# Altium project OSP_DJB_Rigid.PrjPcb
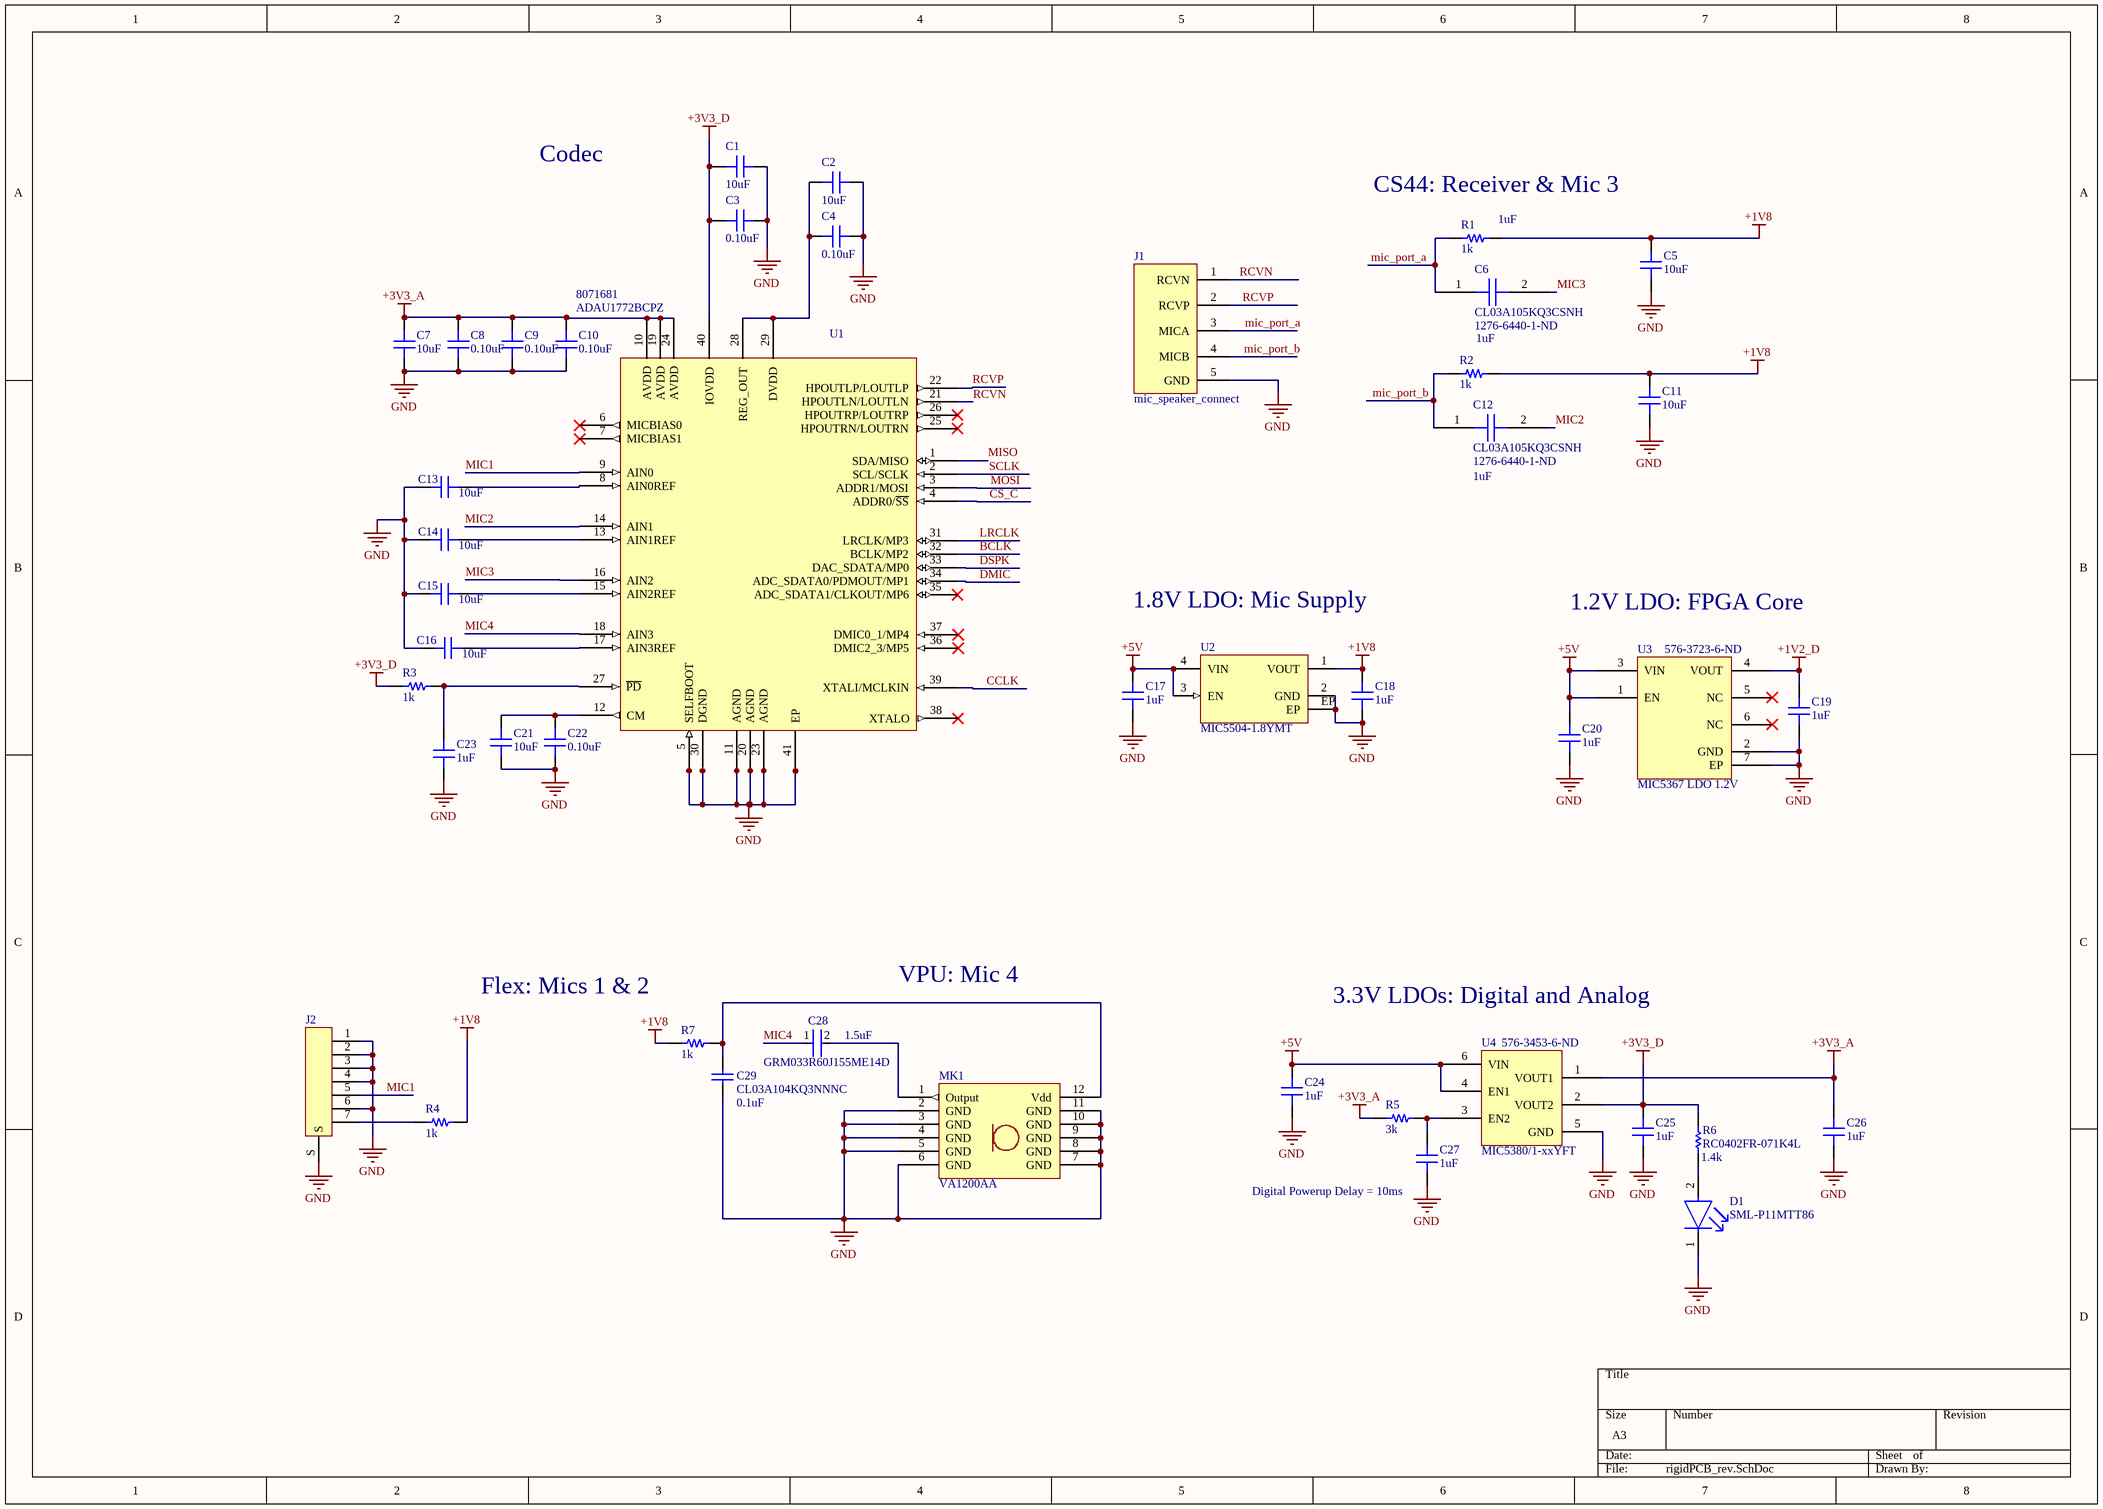
[diagram p0: rigidPCB_rev.SchDoc]
2 sheets, 73 parts. Net scope: global (net labels, ports and power ports of the same name join across sheets).
Board files: djb_v2_rigid_right_1.PcbDoc, djb_v2_rigid_left_2.PcbDoc, djb_v2_rigid_panel.PcbDoc, djb_v2_rigid_left_rev.PcbDoc
Sheets:
  rigidPCB_rev.SchDoc
  rigidPCB2_rev.SchDoc

## Sheet rigidPCB_rev.SchDoc
size A3; SheetNumber: 1; SheetTotal: 2

### Parts
C1  10uF  [CAP 0402/1005]
C2  10uF  [CAP 0402/1005]
C3  0.10uF  [CAP 0201/0603]
C4  0.10uF  [CAP 0201/0603]
C5  10uF  [CAP 0402/1005]
C6  CL03A105KQ3CSNH  Supplier Part Number 1: 1276-6440-1-ND  [CL03A105KQ3CSNH]
C7  10uF  [CAP 0402/1005]
C8  0.10uF  [CAP 0201/0603]
C9  0.10uF  [CAP 0201/0603]
C10  0.10uF  [CAP 0201/0603]
C11  10uF  [CAP 0402/1005]
C12  CL03A105KQ3CSNH  Supplier Part Number 1: 1276-6440-1-ND  [CL03A105KQ3CSNH]
C13  10uF  [CAP 0402/1005]
C14  10uF  [CAP 0402/1005]
C15  10uF  [CAP 0402/1005]
C16  10uF  [CAP 0402/1005]
C17  1uF  [CAP 0201/0603]
C18  1uF  [CAP 0201/0603]
C19  1uF  [CAP 0201/0603]
C20  1uF  [CAP 0201/0603]
C21  10uF  [CAP 0402/1005]
C22  0.10uF  [CAP 0201/0603]
C23  1uF  [CAP 0201/0603]
C24  1uF  [CAP 0201/0603]
C25  1uF  [CAP 0201/0603]
C26  1uF  [CAP 0201/0603]
C27  1uF  [CAP 0201/0603]
C28  GRM033R60J155ME14D  [FP-GRM033-0_03-IPC_B]
C29  CL03A104KQ3NNNC  [CAPC0603X33X15ML03T05]
D1  SML-P11MTT86  [FP-SML-P11MTT86-MFG]
J1  mic_speaker_connect
J2  FFC  [HIROSE_FH58M-7S-0.25SHW-99]  (value not drawn)
MK1  VA1200AA  [VA1200AA]
R1  1k  [RES 0201/0603]
R2  1k  [RES 0201/0603]
R3  1k  [RES 0201/0603]
R4  1k  [RES 0201/0603]
R5  3k  [RES 0201/0603]
R6  RC0402FR-071K4L  [RESC1005X40X25NL05T10]
R7  1k  [RES 0201/0603]
U1  Supplier Part Number 2: 8071681  [ADAU1772BCPZ]
U2  MIC5504-1.8YMT  [MICREL_DFN4]
U3  MIC5367 LDO 1.2V  Supplier Part Number 1: 576-3723-6-ND  [LDO 1.2V]
U4  MIC5380/1-xxYFT  Supplier Part Number 1: 576-3453-6-ND  [06L FCSTSLP]

### Nets
+1V2_D: C19.2 U3.4(VOUT)  [project net VCC]
+1V8: C5.2 C11.2 C18.2 R1.2 R2.2 R4.2 R7.1 U2.1(VOUT)
+3V3_A: C7.1 C8.2 C9.2 C10.2 C26.2 R5.1 U1.10(AVDD) U1.19(AVDD) U1.24(AVDD) U4.1(VOUT1)
+3V3_D: C1.2 C3.1 C25.2 R3.1 R6.2 U1.40(IOVDD) U4.2(VOUT2)  [project net SPI_VCCIO1]
+5V: C17.2 C20.2 C24.2 U2.3(EN) U2.4(VIN) U3.1(EN) U3.3(VIN) U4.4(EN1) U4.6(VIN)
GND: C1.1 C2.1 C3.2 C4.2 C5.1 C7.2 C8.1 C9.1 C10.1 C11.1 C13.2 C14.2 C15.2 C16.2 C17.1 C18.1 C19.1 C20.1 C21.2 C22.1 C23.1 C24.1 C25.1 C26.1 C27.1 C29.1 D1.1(C) J1.5(GND) J2.1 J2.2 J2.3 J2.4 J2.6 J2.S MK1.2(GND) MK1.3(GND) MK1.4(GND) MK1.5(GND) MK1.6(GND) MK1.7(GND) MK1.8(GND) MK1.9(GND) MK1.10(GND) MK1.11(GND) U1.5(SELFBOOT) U1.11(AGND) U1.20(AGND) U1.23(AGND) U1.30(DGND) U1.41(EP) U2.2(GND) U2.EP U3.2(GND) U3.7(EP) U4.5(GND)
BCLK: U1.32(BCLK/MP2)
CCLK: U1.39(XTALI/MCLKIN)
CS_C: U1.4(ADDR0/~{SS})
DMIC: U1.34(ADC_SDATA0/PDMOUT/MP1)
DSPK: U1.33(DAC_SDATA/MP0)
LRCLK: U1.31(LRCLK/MP3)
MIC1: J2.5 U1.9(AIN0)
MIC2: C12.2 U1.14(AIN1)
MIC3: C6.2 U1.16(AIN2)
MIC4: C28.1 U1.18(AIN3)
mic_port_a: C6.1 J1.3(MICA) R1.1
mic_port_b: C12.1 J1.4(MICB) R2.1
MISO: U1.1(SDA/MISO)
MOSI: U1.3(ADDR1/MOSI)
RCVN: J1.1(RCVN) U1.21(HPOUTLN/LOUTLN)
RCVP: J1.2(RCVP) U1.22(HPOUTLP/LOUTLP)
SCLK: U1.2(SCL/SCLK)
NetC2_2: C2.2 C4.1 U1.28(REG_OUT) U1.29(DVDD)
NetC13_1: C13.1 U1.8(AIN0REF)
NetC14_1: C14.1 U1.13(AIN1REF)
NetC15_1: C15.1 U1.15(AIN2REF)
NetC16_1: C16.1 U1.17(AIN3REF)
NetC21_1: C21.1 C22.2 U1.12(CM)
NetC23_2: C23.2 R3.2 U1.27(~{PD})
NetC27_2: C27.2 R5.2 U4.3(EN2)
NetC28_2: C28.2 MK1.1(Output)
NetC29_2: C29.2 MK1.12(Vdd) R7.2
NetD1_2: D1.2(A) R6.1
NetJ2_7: J2.7 R4.1

Not connected (* = marked no-connect by the designer): U1 6(MICBIAS0) 7(MICBIAS1) 25(HPOUTRN/LOUTRN)* 26(HPOUTRP/LOUTRP)* 35(ADC_SDATA1/CLKOUT/MP6)* 36(DMIC2_3/MP5)* 37(DMIC0_1/MP4)* 38(XTALO)*; U3 5(NC)* 6(NC)*

### Notes on the sheet
- Codec
- CS44: Receiver & Mic 3
- (near R1) 1uF
- 1uF
- (near C12) 1uF
- 1.8V LDO: Mic Supply
- 1.2V LDO: FPGA Core
- VPU: Mic 4
- (near J2) Flex: Mics 1 & 2
- (near C28) 1.5uF
- 3.3V LDOs: Digital and Analog
- (near C29) 0.1uF
- (near C27) Digital Powerup Delay = 10ms
- (near R6) 1.4k

### Library data of the parts
C1 C2 C5 C7 C11 C13-C16 C21 = C1005X5R0J106M050BC: CAP CER 10UF 6.3V X5R 0402; Manufacturer: TDK Corporation; TemperatureRange: -55C ~ 85C; Tolerance: 20%; Value: 10uF; Part Number: C1005X5R0J106M050BC; PartId: 12380; Supplier 1: Digi-Key; Supplier Part Number 1: 445-8920-2-ND; ComponentLink1Description: Datasheet; ComponentLink1URL: https://product.tdk.com/info/en/catalog/datasheets/mlcc_commercial_general_en.pdf; ComponentLink2Description: Digi-Key Listing; ComponentLink2URL: https://www.digikey.com/product-detail/en/tdk-corporation/C1005X5R0J106M050BC/445-8920-2-ND/3507809; TemperatureCoefficient: X5R; Voltage: 6.3V; Price: 0.119; Device Package: 0402 (1005 Metric)
C3 C4 C8-C10 C22 = CL03A104KP3NNNC: CAP CER 0.1UF 10V X5R 0201; Manufacturer: Samsung Electro-Mechanics America, Inc.; TemperatureRange: -55C ~ 85C; Tolerance: 10%; Value: 0.10uF; Part Number: CL03A104KP3NNNC; PartId: 20562; Supplier 1: Digi-Key; Supplier Part Number 1: 1276-1115-2-ND; ComponentLink1Description: Datasheet; ComponentLink1URL: http://www.samsungsem.com/kr/support/product-search/mlcc/__icsFiles/afieldfile/2016/08/18/S_CL03A104KP3NNND.pdf; ComponentLink2Description: Digi-Key Listing; ComponentLink2URL: https://www.digikey.com/product-detail/en/samsung-electro-mechanics-america-inc/CL03A104KP3NNNC/1276-1115-2-ND/3886773; TemperatureCoefficient: X5R; Voltage: 10V; Price: 0.0031; Device Package: 0201 (0603 Metric)
C6 C12 = CL03A105KQ3CSNH: 1 µF ±10% 6.3V Ceramic Capacitor X5R 0201 (0603 Metric); Supplier 1: Digi-Key
C17-C20 C23-C27 = 02016D105MAT2A: CAP CER 1UF 6.3V X5R 0201; Manufacturer: AVX Corporation; TemperatureRange: -55C ~ 85C; Tolerance: 20%; Value: 1uF; Part Number: 02016D105MAT2A; PartId: 20442; Supplier 1: Digi-Key; Supplier Part Number 1: 478-7862-2-ND; ComponentLink1Description: Datasheet; ComponentLink1URL: http://datasheets.avx.com/cx5r.pdf; ComponentLink2Description: Digi-Key Listing; ComponentLink2URL: https://www.digikey.com/product-detail/en/avx-corporation/02016D105MAT2A/478-7862-2-ND/3079664; TemperatureCoefficient: X5R; Voltage: 6.3V; Price: 0.063; Device Package: 0201 (0603 Metric)
C28 = CMP-06035-017352-1: Chip Multilayer Ceramic Capacitors for General Purpose, 0201, 1.5uF, X5R, 15%, 20%, 6.3V; Case/Package: 0201; Packaging: Tape and Reel; Case Code (Imperial): 0201; Capacitance: 1.5uF; Max Operating Temperature: 85°C; Voltage Rating (DC): 6.3V; Dielectric: X5R; Min Operating Temperature: -55°C; Voltage Rating: 6.3V; Tolerance: 20%; Mount: Surface Mount; Case Code (Metric): 0603; Thickness: 0.013inch; Length: 0.024inch; Width: 0.012inch
C29 = CMP-2010-00674-1: Manufacturer: Samsung; Part Number: CL03A104KQ3NNNC
D1 = CMP-2000-07126-2: LED YELLOW/GREEN CLEAR 1006 SMD; Forward Current: 20mA; Lens Color: Colorless; Power Rating: 54mW; Lens Style: Diffused; Wavelength: 569nm; Viewing Angle: 150°; Number of LEDs: 1; Test Current: 1mA; Luminous Intensity: 2.1mcd; Illumination Color: Green; Forward Voltage: 1.9V; REACH SVHC: No SVHC; Mount: Surface Mount; Series: PicoLED™; Case Code (Imperial): 0402; Min Operating Temperature: -40°C; Max Operating Temperature: 85°C; Number of Pins: 2; Package Quantity: 1; Height: 0.25mm; Lens Transparency: Clear; Case Code (Metric): 1005; Packaging: Tape and Reel; Width: 0.6mm; Radiation Hardening: No; Case/Package: 0402; Lead Free: Lead Free; Color: Green; RoHS Compliant: Yes; Length: 1mm; Dominant Wavelength: 569nm
J1 = mic_speaker_connect: connector to integrated microphone and speaker
J2 = HIROSE_FH58M-7S-0.25SHW-99: Hirose FH58M-7S-0.25SHW(99) 7-pin Top+Bottom Contact FFC Connector
MK1 = VA1200AA: Bone Conductor Sensor Accelerometer
R1-R4 R7 = RC0201JR-071KL: RES SMD 1K OHM 5% 1/20W 0201; Manufacturer: Yageo; TemperatureRange: -55C ~ 125C; TemperatureCoefficient: 200ppm/C; PowerRating: 0.05W, 1/20W; Value: 1k; Part Number: RC0201JR-071KL; PartId: 19463; Supplier 1: Digi-Key; Supplier Part Number 1: 311-1KNTR-ND; ComponentLink1Description: Datasheet; ComponentLink1URL: http://www.yageo.com/documents/recent/PYu-RC_Group_51_RoHS_L_04.pdf; ComponentLink2Description: Digi-Key Listing; ComponentLink2URL: https://www.digikey.com/product-detail/en/yageo/RC0201JR-071KL/311-1KNTR-ND/1948922; Tolerance: 5%; Price: 0.0042; Device Package: 0201 (0603 Metric)
R5 = RC0201FR-073KL: RES SMD 3K OHM 1% 1/20W 0201; Manufacturer: Yageo; TemperatureRange: -55C ~ 125C; TemperatureCoefficient: 200ppm/C; PowerRating: 0.05W, 1/20W; Value: 3k; Part Number: RC0201FR-073KL; PartId: 19520; Supplier 1: Digi-Key; Supplier Part Number 1: YAG2656TR-ND; ComponentLink1Description: Datasheet; ComponentLink1URL: http://www.yageo.com/documents/recent/PYu-RC_Group_51_RoHS_L_04.pdf; ComponentLink2Description: Digi-Key Listing; ComponentLink2URL: https://www.digikey.com/product-detail/en/yageo/RC0201FR-073KL/YAG2656TR-ND/5280516; Tolerance: 1%; Price: 0.0042; Device Package: 0201 (0603 Metric)
R6 = CMP-2002-07461-1: Manufacturer: Yageo / Phycomp; Part Number: RC0402FR-071K4L
U1 = ADAU1772BCPZ: General Purpose Audio Codec 4ADC / 2DAC Ch 40-Pin LFCSP; Supplier 1: Arrow Electronics; Supplier Part Number 1: ADAU1772BCPZ; Supplier 2: RSComponents
U2 = MICREL_MIC5504-1.8YMT: Micrel MIC5504-1.8YMT 1.8V 300mA LDO
U4 = MIC5380/1-xxYFT: LDO 2fixed Outputs; Supplier 1: Digi-Key
U3 = MIC5367 LDO 1.2V: Supplier 1: Digi-Key

## Sheet rigidPCB2_rev.SchDoc
size A3; SheetNumber: 2; SheetTotal: 2
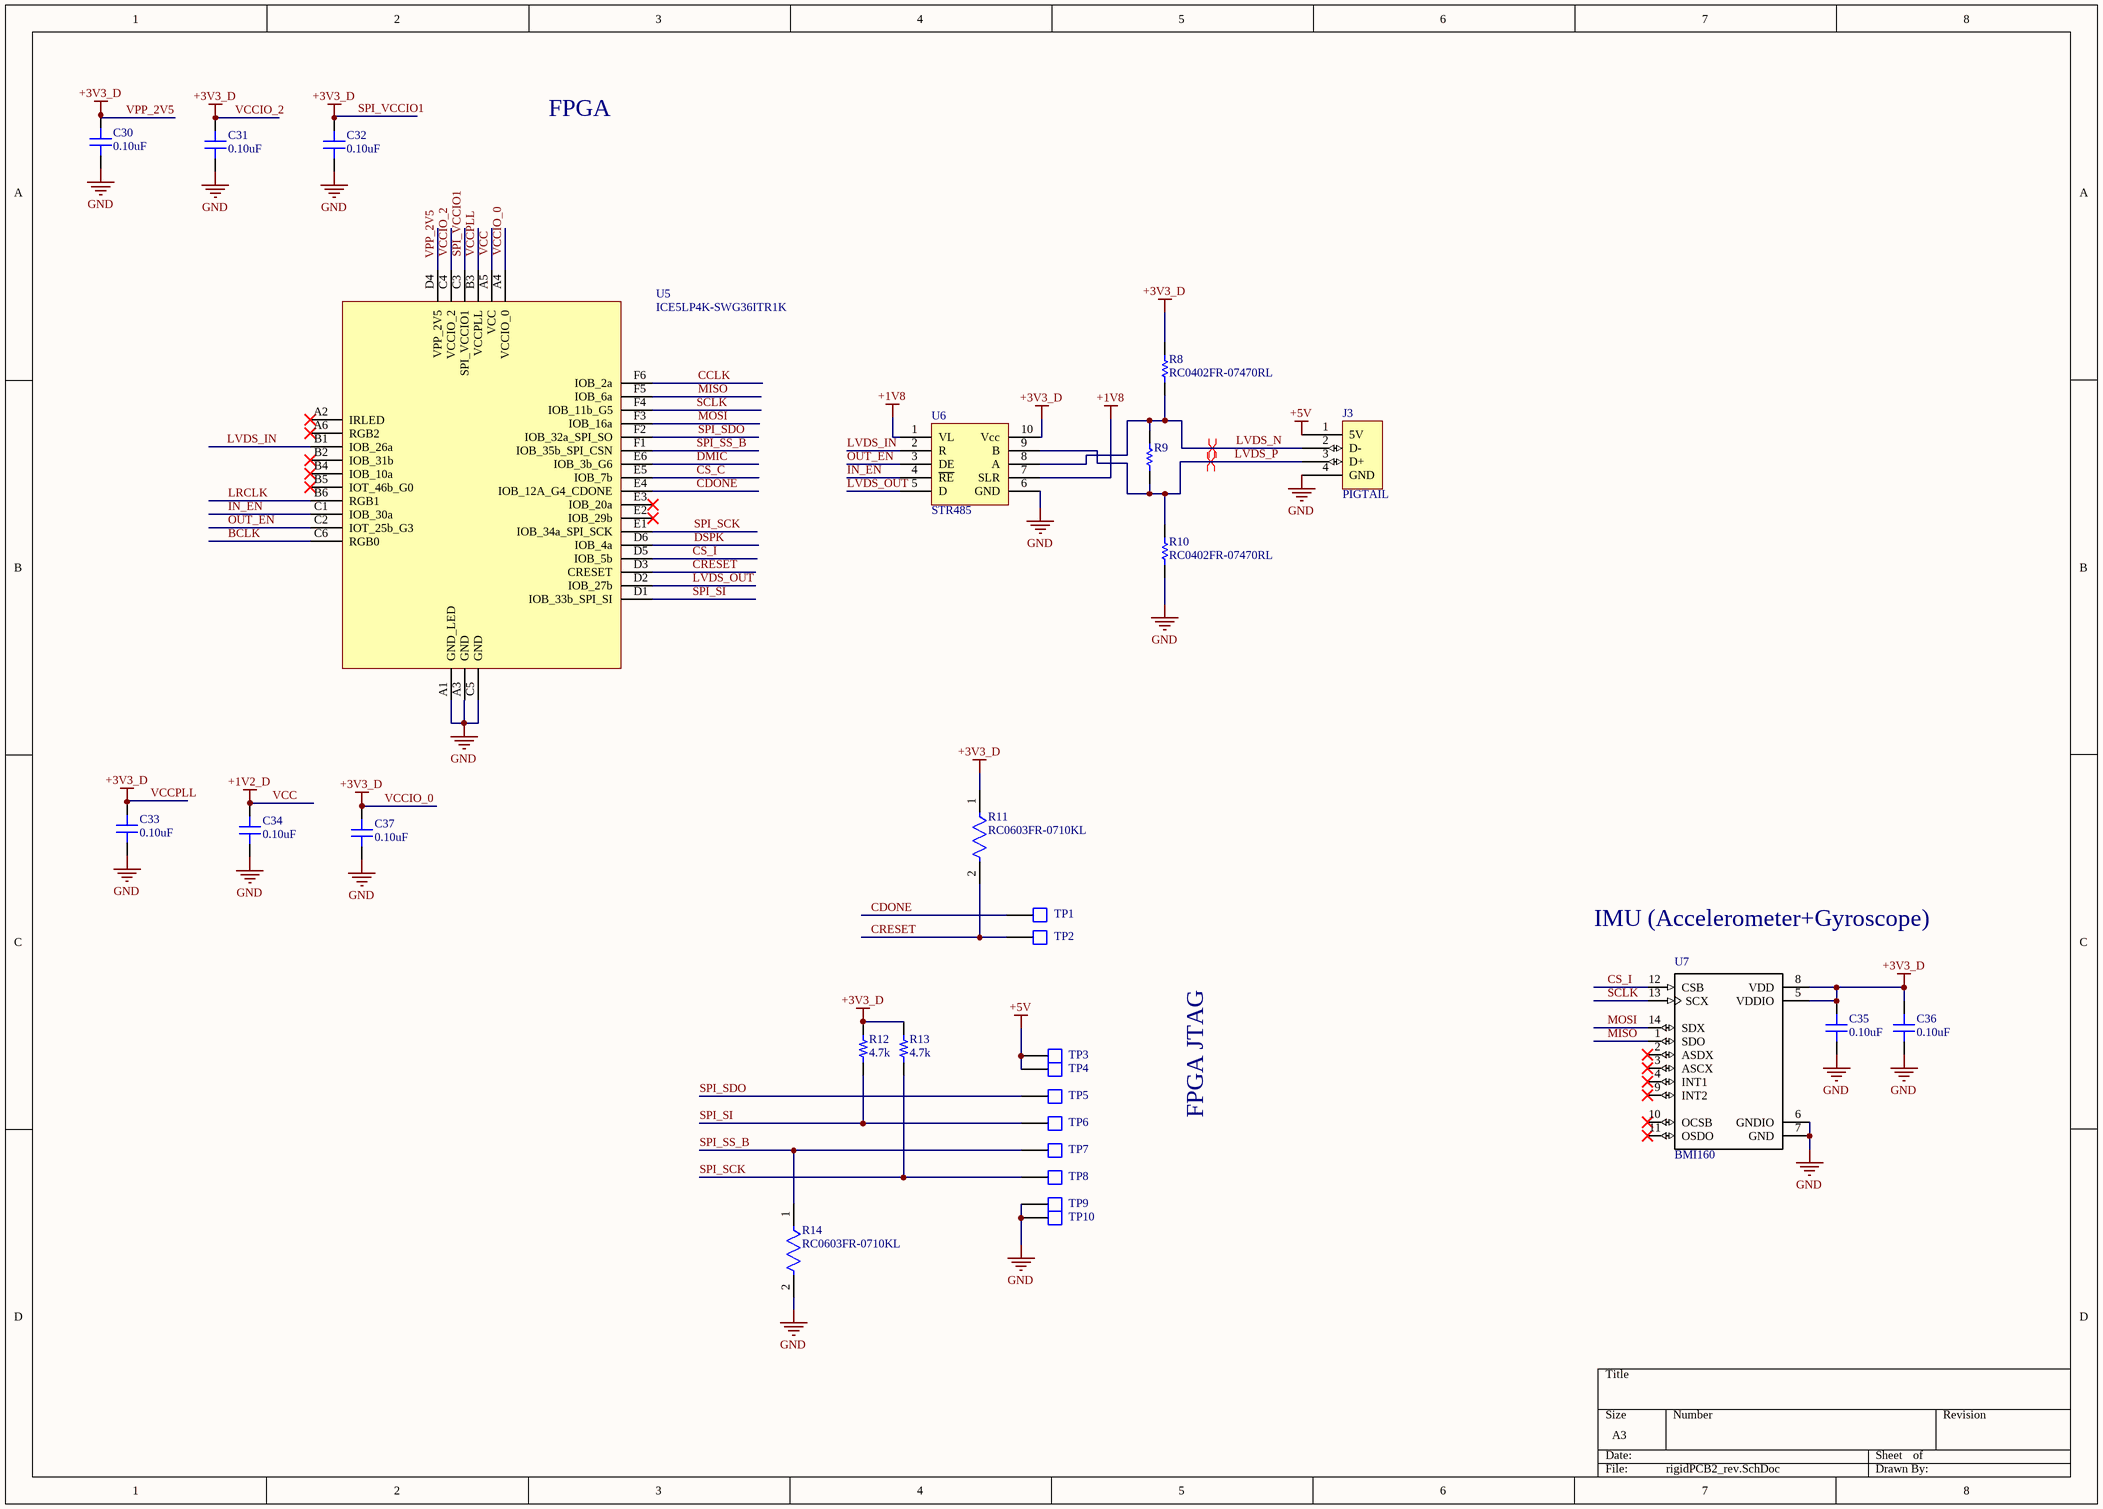
[diagram p1: rigidPCB2_rev.SchDoc]

### Parts
C30  0.10uF  [CAP 0201/0603]
C31  0.10uF  [CAP 0201/0603]
C32  0.10uF  [CAP 0201/0603]
C33  0.10uF  [CAP 0201/0603]
C34  0.10uF  [CAP 0201/0603]
C35  0.10uF  [CAP 0201/0603]
C36  0.10uF  [CAP 0201/0603]
C37  0.10uF  [CAP 0201/0603]
J3  PIGTAIL  [PIGTAIL]
R8  RC0402FR-07470RL  [RESC1005X40X25ML05T10]
R9  RC0402FR-0745R3L  [RESC1005X40X25ML05T10]  (value not drawn)
R10  RC0402FR-07470RL  [RESC1005X40X25ML05T10]
R11  RC0603FR-0710KL  [FP-RC0603-0_55-IPC_C]
R12  4.7k  [RES 0201/0603]
R13  4.7k  [RES 0201/0603]
R14  RC0603FR-0710KL  [FP-RC0603-0_55-IPC_C]
TP1  TP_SMD_DJB  [TP_SMD_DJB]  (value not drawn)
TP2  TP_SMD_DJB  [TP_SMD_DJB]  (value not drawn)
TP3  TP_SMD_DJB  [TP_SMD_DJB]  (value not drawn)
TP4  TP_SMD_DJB  [TP_SMD_DJB]  (value not drawn)
TP5  TP_SMD_DJB  [TP_SMD_DJB]  (value not drawn)
TP6  TP_SMD_DJB  [TP_SMD_DJB]  (value not drawn)
TP7  TP_SMD_DJB  [TP_SMD_DJB]  (value not drawn)
TP8  TP_SMD_DJB  [TP_SMD_DJB]  (value not drawn)
TP9  TP_SMD_DJB  [TP_SMD_DJB]  (value not drawn)
TP10  TP_SMD_DJB  [TP_SMD_DJB]  (value not drawn)
U5  ICE5LP4K-SWG36ITR1K  [36-XFBGA]
U6  STR485  [STR485LVQT]
U7  BMI160  [LGA14R50P5X4_300X250X83]

### Nets
+1V8: U6.1(VL) U6.7(SLR)
+5V: J3.1(5V) TP3.1 TP4.1
GND: C30.1 C31.1 C32.1 C33.1 C34.1 C35.1 C36.1 C37.1 J3.4(GND) R10.1 R14.2 TP9.1 TP10.1 U5.A1(GND_LED) U5.A3(GND) U5.C5(GND) U6.6(GND) U7.6(GNDIO) U7.7(GND)
SPI_VCCIO1: C30.2 C31.2 C32.2 C33.2 C35.2 C36.2 C37.2 R8.2 R11.1 R12.2 R13.2 U5.A4(VCCIO_0) U5.B3(VCCPLL) U5.C3(SPI_VCCIO1) U5.C4(VCCIO_2) U5.D4(VPP_2V5) U6.10(Vcc) U7.5(VDDIO) U7.8(VDD)  [also labelled +3V3_D, VCCIO_0, VCCIO_2, VCCPLL, VPP_2V5]
VCC: C34.2 U5.A5(VCC)  [also labelled +1V2_D]
BCLK: U5.C6(RGB0)
CCLK: U5.F6(IOB_2a)
CDONE: TP1.1 U5.E4(IOB_12A_G4_CDONE)
CRESET: R11.2 TP2.1 U5.D3(CRESET)
CS_C: U5.E5(IOB_7b)
CS_I: U5.D5(IOB_5b) U7.12(CSB)
DMIC: U5.E6(IOB_3b_G6)
DSPK: U5.D6(IOB_4a)
IN_EN: U5.C1(IOB_30a) U6.4(~{RE})
LRCLK: U5.B6(RGB1)
LVDS_IN: U5.B1(IOB_26a) U6.2(R)
LVDS_N: J3.2(D-) R8.1 R9.2 U6.8(A)
LVDS_OUT: U5.D2(IOB_27b) U6.5(D)
LVDS_P: J3.3(D+) R9.1 R10.2 U6.9(B)
MISO: U5.F5(IOB_6a) U7.1(SDO)
MOSI: U5.F3(IOB_16a) U7.14(SDX)
OUT_EN: U5.C2(IOT_25b_G3) U6.3(DE)
SCLK: U5.F4(IOB_11b_G5) U7.13(SCX)
SPI_SCK: R13.1 TP8.1 U5.E1(IOB_34a_SPI_SCK)
SPI_SDO: TP5.1 U5.F2(IOB_32a_SPI_SO)
SPI_SI: R12.1 TP6.1 U5.D1(IOB_33b_SPI_SI)
SPI_SS_B: R14.1 TP7.1 U5.F1(IOB_35b_SPI_CSN)

Not connected (* = marked no-connect by the designer): U5 A2(IRLED)* A6(RGB2)* B2(IOB_31b)* B4(IOB_10a)* B5(IOT_46b_G0)* E2(IOB_29b)* E3(IOB_20a)*; U7 2(ASDX)* 3(ASCX)* 4(INT1)* 9(INT2)* 10(OCSB)* 11(OSDO)*

### Layout directives
differential pair: LVDS_N, LVDS_P

### Notes on the sheet
- FPGA
- IMU (Accelerometer+Gyroscope)
- FPGA JTAG

### Library data of the parts
C30-C37 = CL03A104KP3NNNC: as C3 on sheet rigidPCB_rev; Value: 0.10uF; Part Number: CL03A104KP3NNNC; PartId: 20562; Supplier 1: Digi-Key; Supplier Part Number 1: 1276-1115-2-ND; ComponentLink1Description: Datasheet; ComponentLink1URL: http://www.samsungsem.com/kr/support/product-search/mlcc/__icsFiles/afieldfile/2016/08/18/S_CL03A104KP3NNND.pdf; ComponentLink2Description: Digi-Key Listing; ComponentLink2URL: https://www.digikey.com/product-detail/en/samsung-electro-mechanics-america-inc/CL03A104KP3NNNC/1276-1115-2-ND/3886773; TemperatureCoefficient: X5R; Voltage: 10V; Price: 0.0031; Device Package: 0201 (0603 Metric)
R8 R10 = CMP-2002-07697-1: Manufacturer: Yageo / Phycomp; Part Number: RC0402FR-07470RL
R9 = CMP-2002-07109-1: Manufacturer: Yageo / Phycomp; Part Number: RC0402FR-0745R3L
R11 R14 = CMP-2100-03664-2: RES 10K OHM 1% 1/10W 0603; Voltage Rating: 75V; Voltage Rating (DC): 50V; Resistance: 10kR; Power Rating: 100mW; Temperature Coefficient: 100ppm/°C; Depth: 0.8mm; Termination: SMD/SMT; Resistor Type: Thick Film; Series: RC; Construction: Rectangular; Features: Moisture Resistant; Packaging: Tape and Reel; Min Operating Temperature: -55°C; Number of Terminations: 2; Lead Pitch: 0.3mm; RoHS Compliant: Yes; Case/Package: 0603; Resistance Tolerance: 1%; Military Standard: Not; Weight: 7.1E-05oz; Number of Pins: 2; Tolerance: 1%; Length: 1.6mm; Case Code (Imperial): 0603; Lead Free: Lead Free; Width: 0.8mm; Max Power Dissipation: 100mW; Height: 0.45mm; Max Operating Temperature: 155°C; Case Code (Metric): 1608; Size Code: 0603
R12 R13 = RC0201FR-074K7L: RES SMD 4.7K OHM 1% 1/20W 0201; Manufacturer: Yageo; TemperatureRange: -55C ~ 125C; TemperatureCoefficient: 200ppm/C; PowerRating: 0.05W, 1/20W; Value: 4.7k; Part Number: RC0201FR-074K7L; PartId: 19526; Supplier 1: Digi-Key; Supplier Part Number 1: 311-4.70KMTR-ND; ComponentLink1Description: Datasheet; ComponentLink1URL: http://www.yageo.com/documents/recent/PYu-RC_Group_51_RoHS_L_04.pdf; ComponentLink2Description: Digi-Key Listing; ComponentLink2URL: https://www.digikey.com/product-detail/en/yageo/RC0201FR-074K7L/311-4.70KMTR-ND/1948894; Tolerance: 1%; Price: 0.0056; Device Package: 0201 (0603 Metric)
TP1-TP10 = TP_SMD_DJB: Digital Jellybean Style SMD Test Point; DNP: DNP
U5 = ICE5LP4K-SWG36ITR1K: Field Programmable Gate Array (FPGA) IC 25 65536 1280 36-VFBGA; Supplier 1: Digi-Key
U6 = STR485: 3.3 V LVDS RS485 compatible with 1.8 V I/Os and selectable speed
U7 = BMI160_1: BMI160 2.5 x 3 mm Tiaxial Accelerometer / Gyroscope Inertial Measurement Unit; MF: Bosch; Availability: Good; Package: LGA-14 Bosch; Price: 3.29 USD; MP: BMI160; Value: *

## Nets that join several sheets
+1V8: rigidPCB_rev (8 pins), rigidPCB2_rev (U6.1 U6.7)
+5V: rigidPCB_rev (9 pins), rigidPCB2_rev (J3.1 TP3.1 TP4.1)
GND: rigidPCB_rev (55 pins), rigidPCB2_rev (19 pins)
SPI_VCCIO1: rigidPCB_rev (7 pins), rigidPCB2_rev (19 pins)
VCC: rigidPCB_rev (C19.2 U3.4), rigidPCB2_rev (C34.2 U5.A5)
BCLK: rigidPCB_rev (U1.32), rigidPCB2_rev (U5.C6)
CCLK: rigidPCB_rev (U1.39), rigidPCB2_rev (U5.F6)
CS_C: rigidPCB_rev (U1.4), rigidPCB2_rev (U5.E5)
DMIC: rigidPCB_rev (U1.34), rigidPCB2_rev (U5.E6)
DSPK: rigidPCB_rev (U1.33), rigidPCB2_rev (U5.D6)
LRCLK: rigidPCB_rev (U1.31), rigidPCB2_rev (U5.B6)
MISO: rigidPCB_rev (U1.1), rigidPCB2_rev (U5.F5 U7.1)
MOSI: rigidPCB_rev (U1.3), rigidPCB2_rev (U5.F3 U7.14)
SCLK: rigidPCB_rev (U1.2), rigidPCB2_rev (U5.F4 U7.13)